# Altium schematic sheet Mini-Ph0xx_00.SchDoc: Mini-Ph0xx
size A3; Date: 11/07/2018; DrawnBy: Wim Van Gool; DocumentNumber: 1; Revision: 00; SheetNumber: 1; SheetTotal: 1
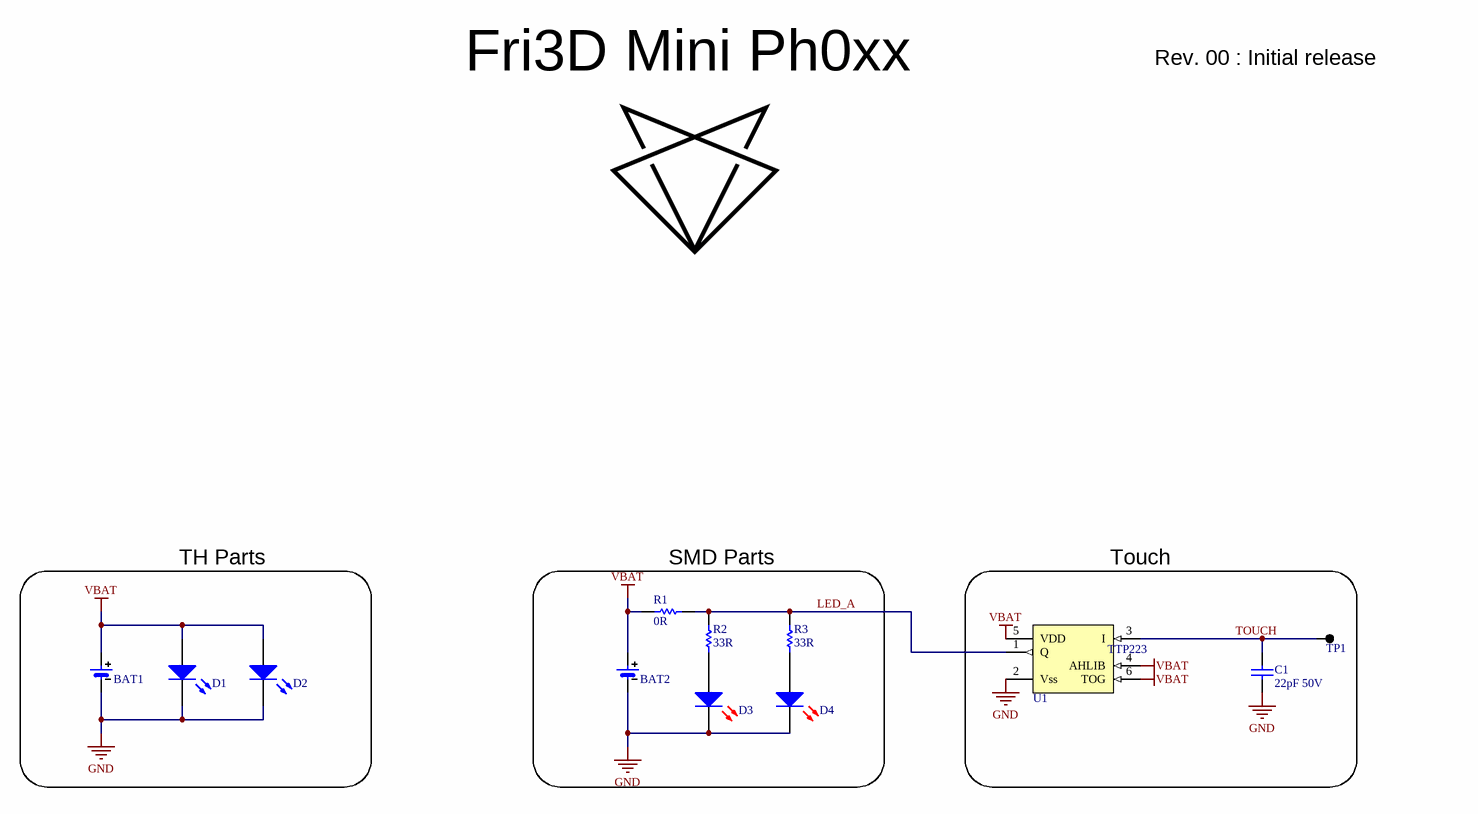
[diagram p0: Mini-Ph0xx_00.SchDoc]

## Parts
BAT1  CR2032 Battery Holder  [BAT_CR2032]  (value not drawn)
BAT2  CR2032 SMD Battery Holder  [BAT_CR2032_KEY_1060]  (value not drawn)
C1  value 22pF 50V  [C1206_N]  (hidden comment: CAP_CERAMIC)
D1  Default 5mm Blue LED  [LED_5MM_BL]  (value not drawn)
D2  Default 5mm Blue LED  [LED_5MM_BL]  (value not drawn)
D3  Default 0805 Red LED  [LED_0805_RD]  (value not drawn)
D4  Default 0805 Red LED  [LED_0805_RD]  (value not drawn)
R1  value 0R  [R1206]  (hidden comment: RESISTOR)
R2  value 33R  [R1206]  (hidden comment: RESISTOR)
R3  value 33R  [R1206]  (hidden comment: RESISTOR)
TP1  TEST_PAD  [TP_0.8mm]  (value not drawn)
U1  Toggle dedicated touch IC  [SOT23-6]  (value not drawn)

## Blocks framed on the sheet
TH Parts: BAT1 D1 D2
SMD Parts: BAT2 D3 D4 R1-R3
Touch: C1 TP1 U1

## Nets
GND: BAT1.2 BAT2.2 C1.2 D1.2(K) D2.2(K) D3.2(K) D4.2(K) U1.2(Vss)
VBAT: BAT1.1 BAT2.1 D1.1(A) D2.1(A) R1.2 U1.4(AHLIB) U1.5(VDD) U1.6(TOG)
LED_A: R1.1 R2.1 R3.1 U1.1(Q)
TOUCH: C1.1 TP1.1 U1.3(I)
NetD3_1: D3.1(A) R2.2
NetD4_1: D4.1(A) R3.2

## Notes on the sheet
- Fri3D Mini Ph0xx
- Rev. 00 : Initial release
- Title
- Revision
- Date
- Dranw By
- Size
- A3
- Sheet
- of

## Library data of the parts
BAT1 = BAT 20mm Coin Cell Holder Generic: =Description; Value: CR2032; Supplier 1: China
BAT2 = BAT # 20mm Coin Cell Holder Keystone 1060: =Description; Value: CR2032; Supplier 1: Digi-key; Supplier Part Number 1: 36-1060-ND; Supplier 2: Aliexpress
C1 = CAP # 22pF 50V 1206: Capacitor Ceramic
D1 D2 = LED Blue 5mm: =Description
D3 D4 = LED # Red 0805: =Description; Supplier 1: Farnell; Supplier Part Number 1: 2099236
R1 = RES # 0R 1206: Supplier 1: Farnell; Supplier Part Number 1: 2497983
R2 R3 = RES # 33R 1206
TP1 = TP # 0.8mm: Value: NO BOM
U1 = TOUCH # TTP223: =Description; Value: TTP223; Supplier 1: Aliexpress; Supplier Part Number 1: TTP223